# EAGLE schematic igonzocam_motionsensor (EAGLE 6.5.0)
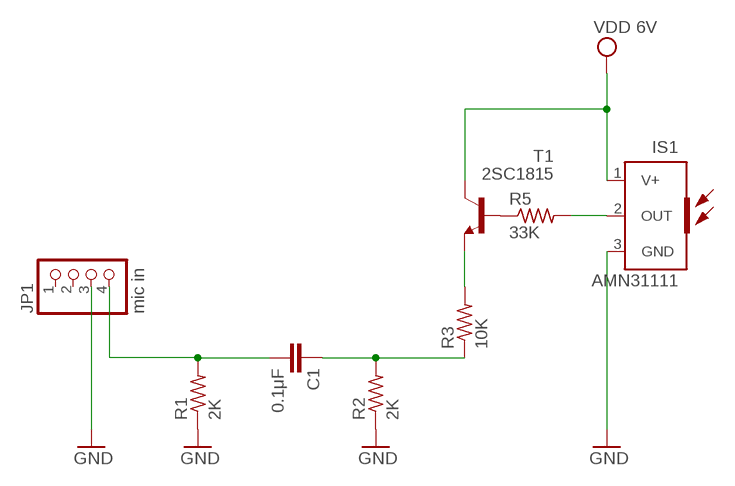
[diagram p0: schematic, sheet 1]

## Parts
C1  0.1μF  C5/3  [C5B3]
IS1  AMN31111  LME-346-F  [TO39]
JP1  mic in  PINHD-1X4  [1X04]
R1  2K  R-US_0204/7  [0204/7]
R2  2K  R-US_0204/7  [0204/7]
R3  10K  R-US_0204/7  [0204/7]
R5  33K  R-US_0204/7  [0204/7]
T1  2SC1815  [TO92-ECB]

## Nets
GND: IS1.3(GND) JP1.3 R1.1 R2.1
N$1: C1.2 JP1.4 R1.2
N$2: C1.1 R2.2 R3.1
N$4: R5.1 T1.B
N$5: IS1.2(OUT) R5.2
N$6: R3.2 T1.E
VDD: IS1.1(V+) T1.C ; supply symbol labelled VDD 6V
Unconnected: JP1.1 JP1.2

## Library data of the parts
C1 = capacitor-wima:C: CAPACITOR naming: grid - package width
IS1 = sensor-infratec:LME-346-F: pyroelectric detector Source: http://www.InfraTec.de .. Datasheet_S85159.pdf; OC_FARNELL: unknown; OC_NEWARK: unknown
JP1 = pinhead:PINHD-1X4: PIN HEADER
R1-R3 R5 = resistor:R-US_: RESISTOR, American symbol
T1 = transistor:2SC1815: NPN EPITAXIAL TRANSISTOR Source: TOSHIBA .. 2SC1815 1.pdf